# Altium schematic sheet Switching_Scheme.SchDoc
size A
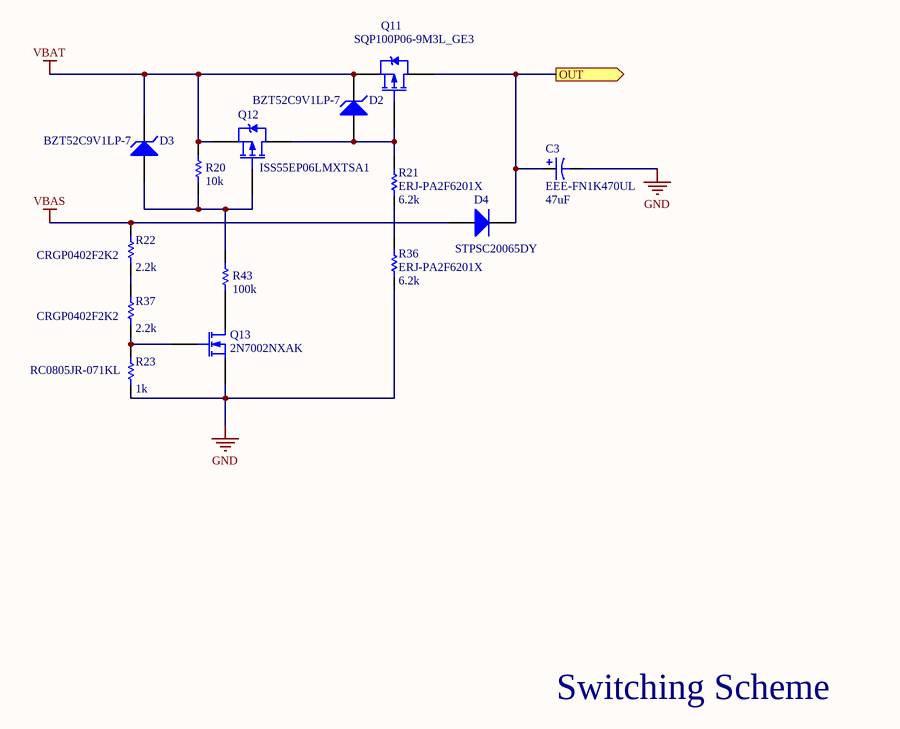
[diagram p0: Switching_Scheme.SchDoc]

## Parts
C3  EEE-FN1K470UL  value 47uF  [CAPAE1030X1450N]
D2  BZT52C9V1LP-7  [0402]
D3  BZT52C9V1LP-7  [0402]
D4  STPSC20065DY  [TO-220AC]
Q11  SQP100P06-9M3L_GE3  [TO-220AB]
Q12  ISS55EP06LMXTSA1  [SOT23_L]
Q13  2N7002NXAK  [SOT23_L]
R20  value 10k  [0402]  (hidden comment: RC0402FR-0710KL)
R21  ERJ-PA2F6201X  value 6.2k  [0402]
R22  CRGP0402F2K2  value 2.2k  [0402]
R23  RC0805JR-071KL  value 1k  [0402]
R36  ERJ-PA2F6201X  value 6.2k  [0402]
R37  CRGP0402F2K2  value 2.2k  [0402]
R43  value 100k  [0402]  (hidden comment: RC0402FR-0710KL)

## Ports
OUT (out)

## Nets
GND: C3.2 Q13.3(S) R23.1 R36.2
VBAS: D4.1(A) R22.2
VBAT: D2.2(K) D3.2(K) Q11.3(S) Q12.3(S) R20.2
OUT: C3.1 D4.2(K) Q11.2(D) ; port OUT
NetD2_1: D2.1(A) Q11.1(G) Q12.2(D) R21.1
NetD3_1: D3.1(A) Q12.1(G) R20.1 R43.2
NetQ13_1: Q13.1(D) R43.1
NetQ13_2: Q13.2(G) R23.2 R37.1
NetR21_2: R21.2 R36.1
NetR22_1: R22.1 R37.2

## Notes on the sheet
- Switching Scheme

## Library data of the parts
C3 = Cap Pol1: 80VDC 47uF 20% 8x10.2mm AEC-Q200; MFG PN: EEH-ZF1J330P; MFG: Panasonic
D2 D3 = D Zener: Zener Diode 9.1V 250mW ±6% Surface Mount X1-DFN1006-2; MFG: Diodes Incorporated; Package: 0402; MFG PN: BZT52C9V1LP-7
D4 = Diode: Diode Silicon Carbide Schottky 650V 20A Through Hole TO-220AC; pin to pad: 2>3; MFG: STMicroelectronics; MFG PN: STPSC20065DY
Q11 = PMOS-2: P-Channel 60V 100A (Tc) 187W (Tc) Through Hole TO-220AB; Published: 8-Jun-2000; LatestRevisionDate: 17-Jul-2002; LatestRevisionNote: Re-released for DXP Platform.; DatasheetVersion: PD-9.390D; PackageVersion: Feb-1997; PackageReference: TO-220AB; Publisher: Vishay Siliconix; PackageDescription: TO, Thru-Hole, Vertical, Heatsink Mounted; 3 In-Line Leads; Pitch 2.54 mm; ComponentLink1Description: Manufacturer Link; ComponentLink1URL: http://www.irf.com/
Q12 = PMOS-2: P-Channel 60V 180mA (Ta) 400mW (Ta) Surface Mount PG-SOT23-3-5; MFG: Infineon Technologies; PackageReference: TO-220AB; Publisher: ISS55EP06LMXTSA1; ComponentLink1Description: Manufacturer Link; ComponentLink1URL: http://www.irf.com/; MFG PN: ISS55EP06LMXTSA1
Q13 = MOSFET-N: N-Channel 60V 190mA (Ta), 300mA (Tc) 265mW (Ta), 1.33W (Tc) Surface Mount TO-236AB; MFG: Nexperia USA; MDF PN: 2N7002NXAK
R20 R43 = Res1: 10 kOhms ±1% 0.063W, 1/16W Chip Resistor 0402 (1005 Metric) Thick Film; Manufacturer: Yageo; MFG PN: RC0402FR-0710KL
R21 R36 = Res1: ±1% 0.2W, 1/5W Chip Resistor 0402 (1005 Metric) Automotive AEC-Q200, Pulse Withstanding Thick Film; Manufacturer: Panasonic Electronic Components; PackageDescription: ±1% 0.2W, 1/5W Chip Resistor 0402 (1005 Metric) Automotive AEC-Q200, Pulse Withstanding Thick Film; MFG PN: ERJ-PA2F6201X
R22 R37 = Res1: 2.2 kOhms ±1% 0.125W, 1/8W Chip Resistor 0402 (1005 Metric) Pulse Withstanding Thick Film; MFG: TE Connectivity Passive Product; MFG PN: CRGP0402F2K2
R23 = Res1: 1 kOhms ±5% 0.125W, 1/8W Chip Resistor 0805 (2012 Metric)  Thick Film; MFG: Yageo; MFG PN: RC0805JR-071KL